# EAGLE design NICK_REEAL_SCHEMATIC (EAGLE 8.2.1)
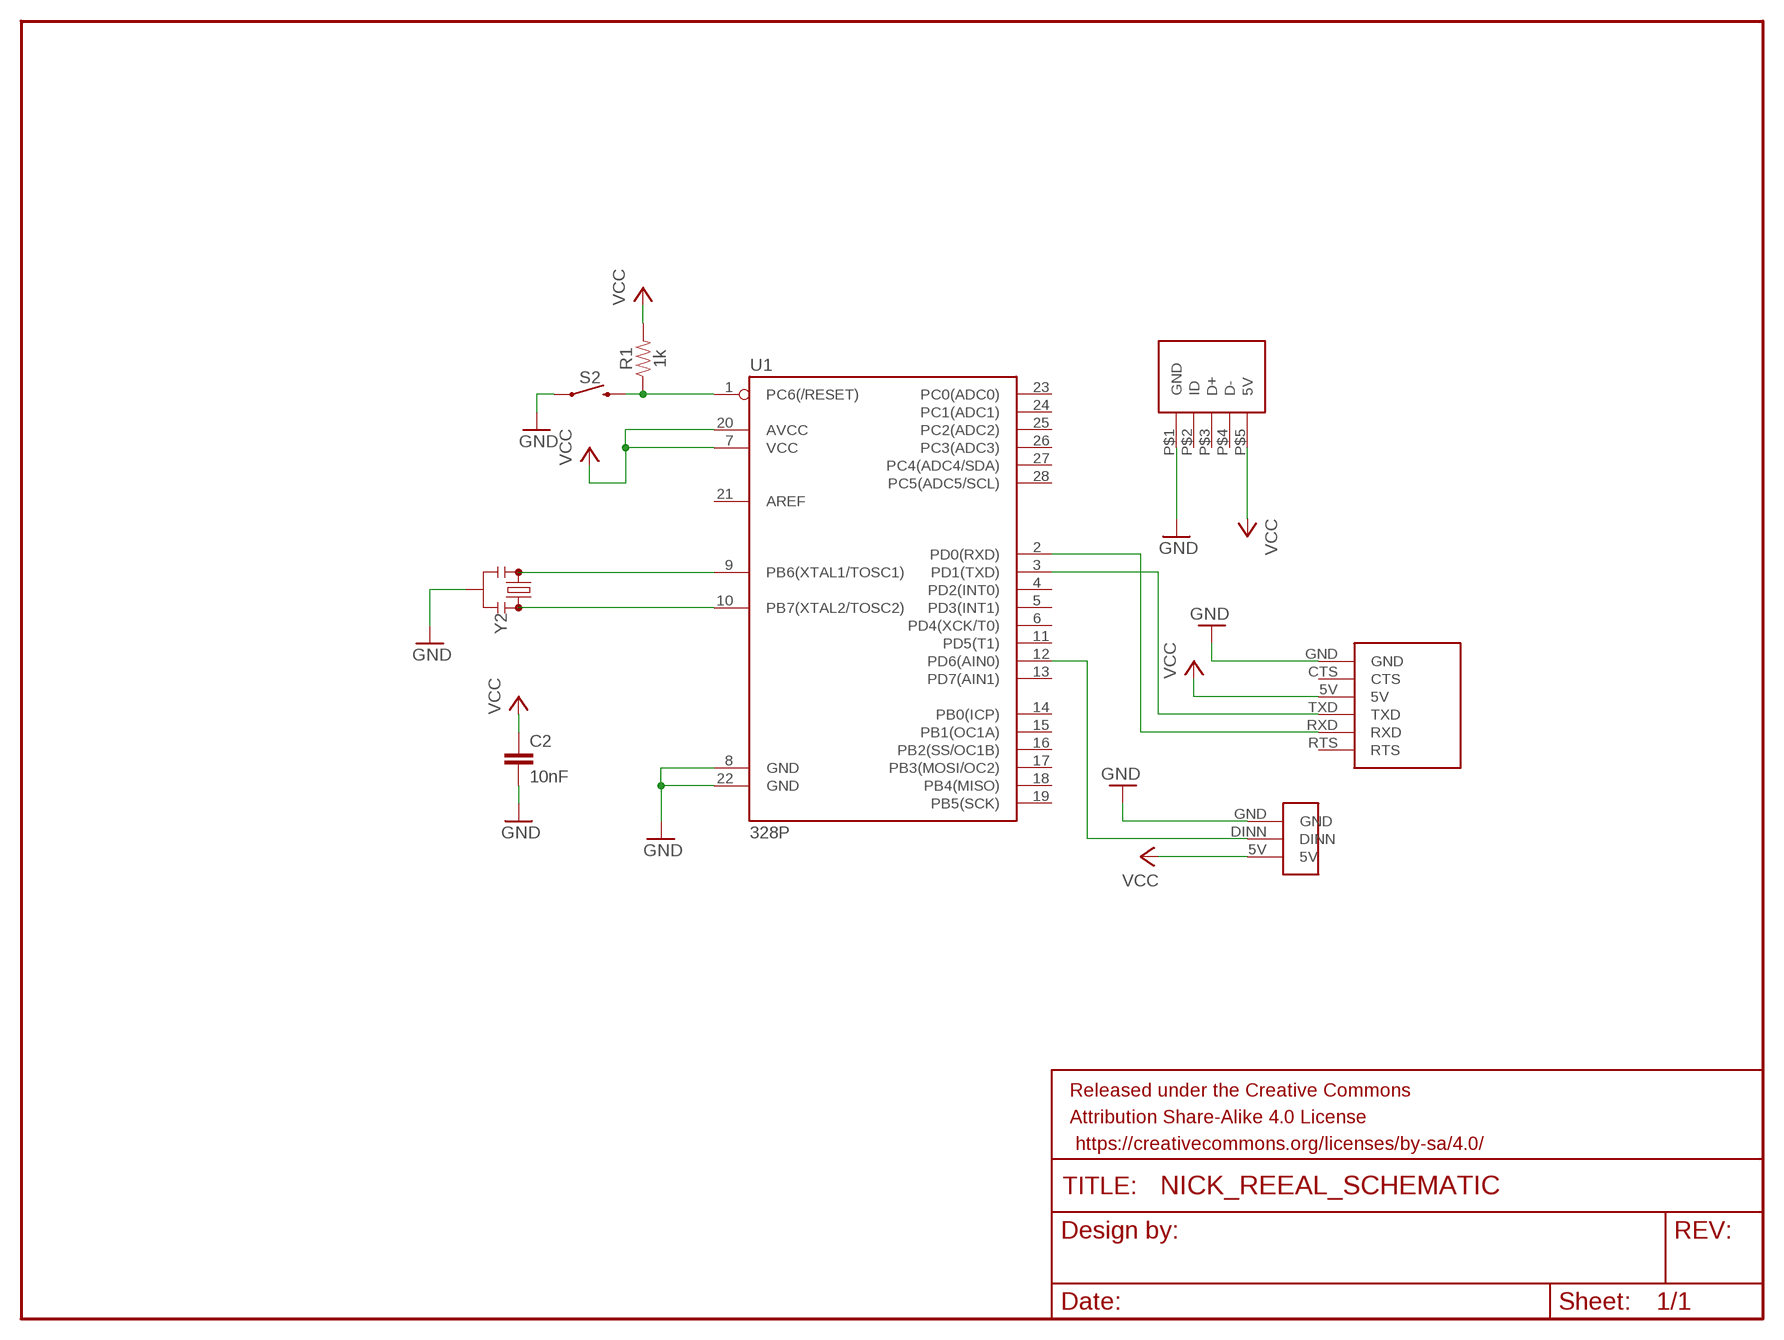
[diagram p0: schematic, sheet 1]

## Parts
C2  10nF  10NF-PTH-10MM-10000V-1-%  [CAP-PTH-10MM]
FRAME1  FRAME-LETTERNO_PACKAGE  [DUMMY]
R1  1k  1KOHM-HORIZ-1/4W-1%  [AXIAL-0.3]
S2  MOMENTARY-SWITCH-SPST-PTH-6.0MM  [TACTILE_SWITCH_PTH_6.0MM]
U1  328P  ATMEGA328P_PDIP  [DIP28]
U$1  USBCONNECTER  [USBCONNECTER]
U$2  PROGRAMCABLE  [PROGRAMCABLE]
U$3  8LEDCONNECTER  [8LEDCONNECTER]
Y2  RESONATORPTH-7.6X3.8  [RESONATOR-PTH-7.6X3.8]

## Nets
GND: C2.2 S2.1 U1.8(GND) U1.22(GND) U$1.P$1(GND) U$2.GND U$3.GND Y2.2
N$1: U1.9(PB6(XTAL1/TOSC1)) Y2.3
N$2: U1.10(PB7(XTAL2/TOSC2)) Y2.1
N$3: U1.3(PD1(TXD)) U$2.TXD
N$4: R1.P$1 S2.3 U1.1(PC6(/RESET))
N$5: U1.2(PD0(RXD)) U$2.RXD
N$6: U1.12(PD6(AIN0)) U$3.DINN
VCC: C2.1 R1.P$2 U1.7(VCC) U1.20(AVCC) U$1.P$5(5V) U$2.5V U$3.5V
Unconnected: U1.4(PD2(INT0)) U1.5(PD3(INT1)) U1.6(PD4(XCK/T0)) U1.11(PD5(T1)) U1.13(PD7(AIN1)) U1.14(PB0(ICP)) U1.15(PB1(OC1A)) U1.16(PB2(SS/OC1B)) U1.17(PB3(MOSI/OC2)) U1.18(PB4(MISO)) U1.19(PB5(SCK)) U1.21(AREF) U1.23(PC0(ADC0)) U1.24(PC1(ADC1)) U1.25(PC2(ADC2)) U1.26(PC3(ADC3)) U1.27(PC4(ADC4/SDA)) U1.28(PC5(ADC5/SCL)) U$1.P$2(ID) U$1.P$3(D+) U$1.P$4(D-) U$2.CTS U$2.RTS

## Library data of the parts
C2 = nick:10NF: 0.01uF/10nF/10,000pF ceramic capacitors A capacitor is a passive two-terminal electrical component used to store electrical energy temporarily in an electric field. CAP-09321; PROD_ID: CAP-09321
FRAME1 = SparkFun-Aesthetics:FRAME-LETTER: Schematic Frame - Letter Standard 8.5x11 US Letter frame; DESIGNER: Nobody; VERSION: v01
R1 = nick:1KOHM: 1kΩ resistor A resistor is a passive two-terminal electrical component that implements electrical resistance as a circuit element. Resistors act to reduce current flow, and, at the same time, act to lower voltage levels within circuits. - Wikipedia; PROD_ID: RES-12182
S2 = nick:MOMENTARY-SWITCH-SPST: Momentary Switch (Pushbutton) - SPST Normally-open (NO) SPST momentary switches (buttons, pushbuttons). Variants PTH-12MM - 12mm square, through-hole Momentary Pushbutton Switch - 12mm Square <https://www.sparkfun.com/products/9190> (COM-09190) PTH-6.0MM, PTH-6.0MM-KIT - 6.0mm square, through-hole Mini Pushbutton Switch <https://www.sparkfun.com/products/97> (COM-00097) KIT package intended for soldering kit's - only one side of pads' copper is exposed. PTH-RIGHT-ANGLE-KIT - Right-angle, through-hole Right Angle Tactile Button <https://www.sparkfun.com/products/10791> - Used on SparkFun BigTime Watch Kit <https://www.sparkfun.com/products/11734> SMD-12MM - 12mm square, surface-mount Tactile Button - SMD (12mm) <https://www.sparkfun.com/products/12993> (COM-12993) Used on SparkFun PicoBoard <https://www.sparkfun.com/products/11888> SMD-4.5MM - 4.5mm Square Trackball Switch Used on SparkFun Blackberry Trackballer Breakout <https://www.sparkfun.com/products/13169> SMD-4.6MMX2.8MM - 4.60mm x 2.80mm, surface mount Used on SparkFun SAMD21 Mini Breakout <https://www.sparkfun.com/products/13664> SMD-5.2MM, SMD-5.2-REDUNDANT - 5.2mm square, surface-mount Mini Pushbutton Switch - SMD <https://www.sparkfun.com/products/8720> (COM-08720) Used on Arduino Pro Mini <https://www.sparkfun.com/products/11114> REDUNDANT package connects both switch circuits together SMD-6.0X3.5MM - 6.0 x 3.5mm, surface mount Momentary Reset Switch SMD <https://www.sparkfun.com/products/8229> (COM-08229) SMD-6.2MM-TALL - 6.2mm square, surface mount Tactile Button - SMD (6mm) <https://www.sparkfun.com/products/12992> Used on SparkFun Digital Sandbox <https://www.sparkfun.com/products/12651> SMD-RIGHT-ANGLE - Right-angle, surface mount Used on SparkFun Block for Intel® Edison - Arduino <https://www.sparkfun.com/products/13036>; PROD_ID: SWCH-08441; SF_SKU: COM-00097
U1 = nick:ATMEGA328P_PDIP: Atmel 328P Through hole ATMEGA328P uC used in the Arduino 32kb flash, 1k EEPROM, 2k SRAM Datasheet <http://www.sparkfun.com/datasheets/Components/SMD/ATMega328.pdf> SparkFun Products Storefront component: AVR 28 Pin 20MHz 32K 6A/D - ATMega328P <https://www.sparkfun.com/products/9061> (COM-09061) SparkFun Simon Says - Through-Hole Soldering Kit <https://www.sparkfun.com/products/10547> (KIT-10547) SparkFun Learn to Solder - Simon Says <https://www.sparkfun.com/products/13708> (KIT-13708) SparkFun BigTime Watch Kit <https://www.sparkfun.com/products/11734> (KIT-11734) SparkFun ClockIt <https://www.sparkfun.com/products/10930> (KIT-10930) SparkFun Serial Enabled LCD Kit <https://www.sparkfun.com/products/10097> (LCD-10097) SparkFun Simon Tilts - Through Hole Soldering Kit <https://www.sparkfun.com/products/12634> (KIT-12634) SparkFun Frequency Counter Kit <https://www.sparkfun.com/products/10140> (KIT-10140) FabFM Radio Kit <https://www.sparkfun.com/products/11043> (KIT-11043) SparkFun Binary Blaster Kit <https://www.sparkfun.com/products/12037> (KIT-12037) SparkFun Metro-Gnome <https://www.sparkfun.com/products/9236> (KIT-09236) ATmega328 with Arduino Optiboot (Uno) <https://www.sparkfun.com/products/10524> (DEV-10524); PROD_ID: IC-09136
U$1 = nick:USBCONNECTER
U$2 = nick:PROGRAMCABLE
U$3 = nick:8LEDCONNECTER
Y2 = nick:RESONATOR: Resonators (Generic) Ceramic resonators are clock-generating components, often used to control timing in microcontrollers. They usually have 3 pins: two pins for oscillation, and one pin for ground. Compared to crystals, resonators have worse tolerance, but are usually much cheaper. Plus, they have built-in load capacitors! These devices are used on boards like the Arduino Pro 8MHz <https://www.sparkfun.com/products/11114> and Arduino Pro 16MHz <https://www.sparkfun.com/products/11113>.

## Net classes
0 default: width 0.457 mm, drill 0.457 mm, clearance 0.457 mm

## Board
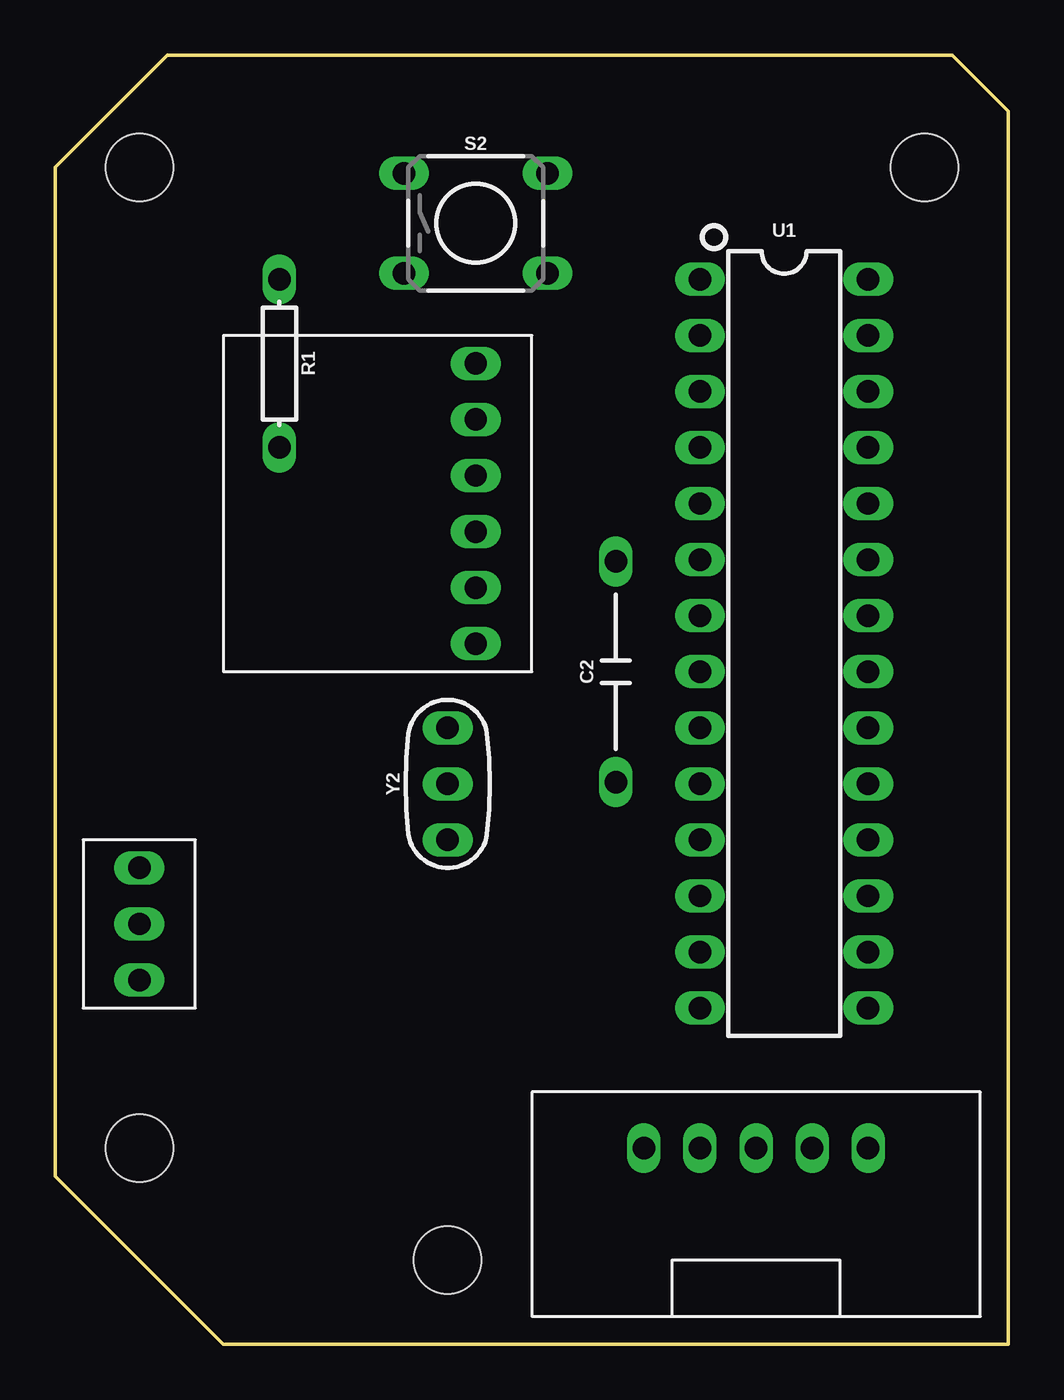
[diagram p1: board, top side]
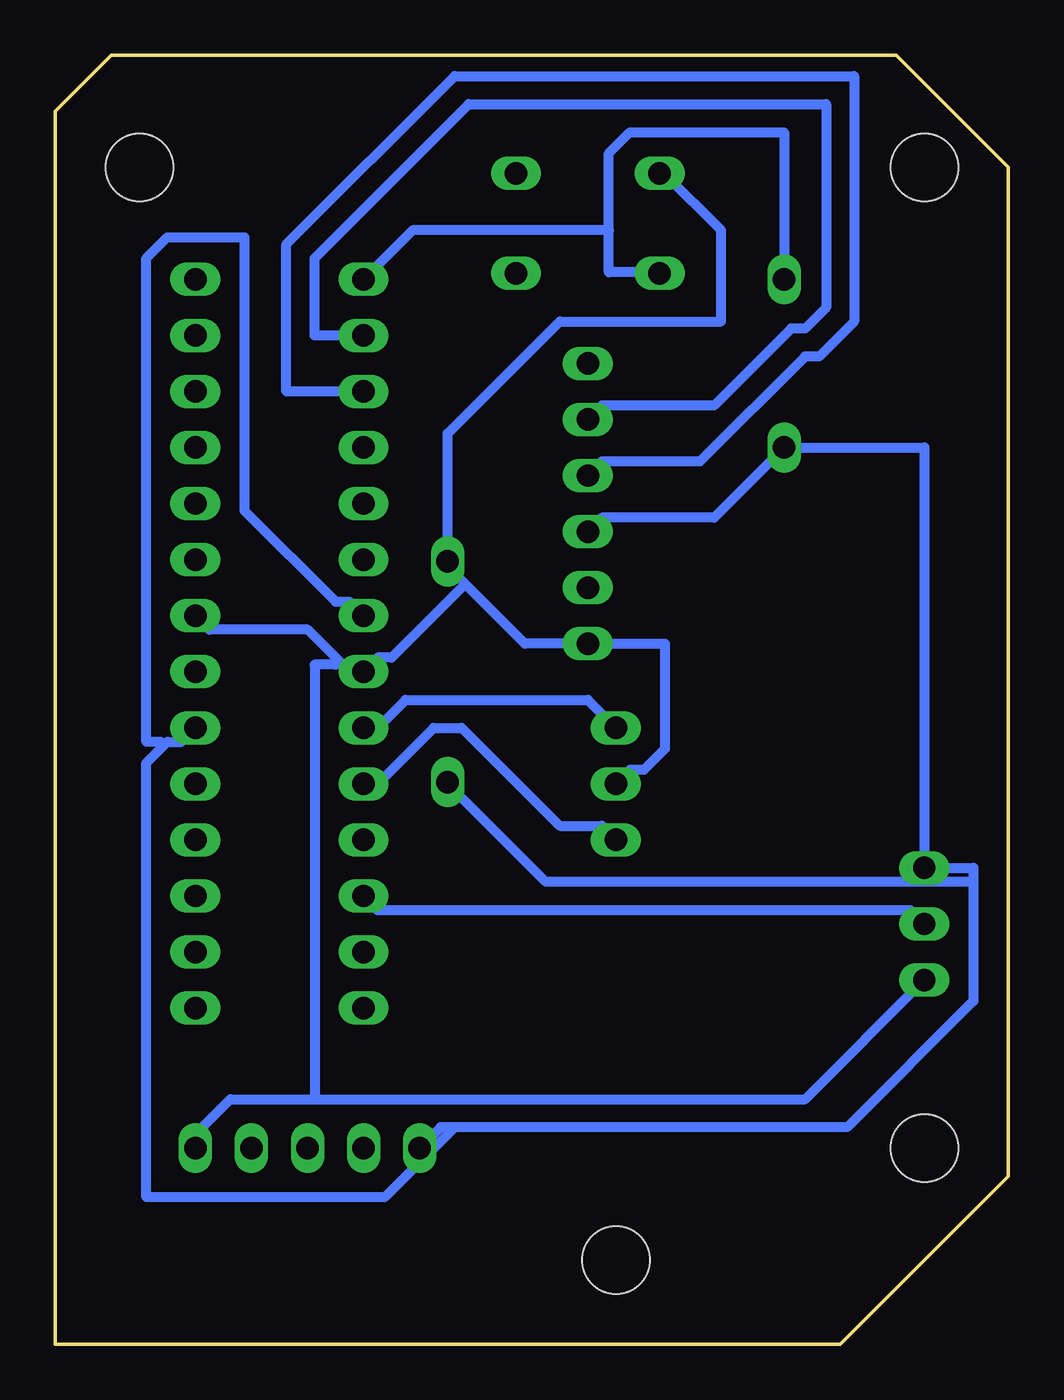
[diagram p2: board, bottom side, seen from below]

Size 43.18 x 58.42 mm. Coordinates in mm from the lower left corner, seen from the top.
Outline: 43.18,0 43.18,55.88 40.64,58.42 5.08,58.42 0,53.34 0,7.62 7.62,0 43.18,0
Copper layers (1*16): Top 0.035mm / dielectric 1.5mm / Bottom 0.035mm
Design rules "OthermillDRC_1_32_v2": minimum track width 8mil, minimum drill 0.8mm, track to track 0.794003125mm, track to pad 0.794003125mm, pad to pad 0.794003125mm, via to via 0.794003125mm, smd to smd 0mil, copper to edge 0mil, drill to drill 1mil, minimum pad ring 10mil, minimum via ring 10mil, stop-mask expansion 1mil, vias tented up to drill 30mil, thermal gap 10mil
Holes 3.05 mm at 3.81,8.89 17.78,3.81 3.81,53.34 39.37,53.34

### Footprints (pad centres in the part's own frame; a part is rotated, then mirrored left to right if it is on the bottom)
CAP-PTH-10MM = drill 1.016 long: 1 -5,0; 2 5,0
AXIAL-0.3 = drill 1.016 long: P$1 -3.81,0; P$2 3.81,0
TACTILE_SWITCH_PTH_6.0MM = drill 1.016 long: 1 -3.251,2.261; 2 3.251,2.261; 3 -3.251,-2.261; 4 3.251,-2.261
DIP28 = drill 1.016 long: 1 -16.51,-3.81; 2 -13.97,-3.81; 3 -11.43,-3.81; 4 -8.89,-3.81; 5 -6.35,-3.81; 6 -3.81,-3.81; 7 -1.27,-3.81; 8 1.27,-3.81; 9 3.81,-3.81; 10 6.35,-3.81; 11 8.89,-3.81; 12 11.43,-3.81; 13 13.97,-3.81; 14 16.51,-3.81; 15 16.51,3.81; 16 13.97,3.81; 17 11.43,3.81; 18 8.89,3.81; 19 6.35,3.81; 20 3.81,3.81; 21 1.27,3.81; 22 -1.27,3.81; 23 -3.81,3.81; 24 -6.35,3.81; 25 -8.89,3.81; 26 -11.43,3.81; 27 -13.97,3.81; 28 -16.51,3.81
USBCONNECTER = drill 1.016 long: P$1 5.08,2.54; P$2 7.62,2.54; P$3 10.16,2.54; P$4 12.7,2.54; P$5 15.24,2.54
PROGRAMCABLE = drill 1.016 long: 5V 6.35,2.54; CTS 3.81,2.54; GND 1.27,2.54; RTS 13.97,2.54; RXD 11.43,2.54; TXD 8.89,2.54
8LEDCONNECTER = drill 1.016 long: 5V 3.81,0; DINN 1.27,0; GND -1.27,0
RESONATOR-PTH-7.6X3.8 = drill 1.016 long: 1 -2.54,0; 2 0,0; 3 2.54,0

### Placement (x,y rotation side)
C2  25.4,30.48 90 top
FRAME1  -91.44,29.21 0 top  (outside the outline)
R1  10.16,44.45 270 top
S2  19.05,50.8 0 top
U1  33.02,31.75 270 top
U$1  41.91,11.43 180 top
U$2  21.59,30.48 90 top
U$3  3.81,17.78 90 top
Y2  17.78,25.4 90 top

### Tracks (layer width: path | path; a pad name or v marks a point on that pad's centre or on a via)
GND
  Bottom 0.457: U$3.GND 9.21,11.11 31.43,11.11 | 31.43,11.11 35.24,11.11 36.83,9.52 U$1.P$1 | Y2.2 17.14,26.04 16.51,26.04 15.56,26.99 15.56,31.75 U$2.GND 21.91,31.75 24.61,34.45 | 24.61,34.45 25.4,35.24 C2.2 25.4,41.28 20.32,46.35 13.02,46.35 13.02,50.48 15.56,53.02 S2.1 | 24.61,34.45 27.94,31.11 28.58,31.11 U1.8 29.21,30.8 30.16,30.8 30.32,30.96 | U1.22 36.19,32.39 31.75,32.39 30.32,30.96 | 31.43,11.11 31.43,30.8 30.48,30.8 30.32,30.96
N$1
  Bottom 0.457: Y2.3 19.05,29.21 27.3,29.21 28.58,27.94 U1.9
N$2
  Bottom 0.457: Y2.1 18.41,23.5 20.32,23.5 24.77,27.94 26.03,27.94 28.58,25.4 U1.10
N$3
  Bottom 0.457: U$2.TXD 18.41,40 13.97,40 9.21,44.77 8.57,44.77 6.98,46.35 6.98,57.47 25.08,57.47 32.7,49.85 32.7,43.18 U1.3
N$4
  Bottom 0.457: R1.P$1 10.16,54.93 17.14,54.93 18.1,53.97 18.1,50.48 | 18.1,50.48 18.1,48.58 15.88,48.58 S2.3 | U1.1 26.99,50.48 18.1,50.48
N$5
  Bottom 0.457: U$2.RXD 18.41,42.55 13.34,42.55 9.84,46.04 9.21,46.04 8.25,46.99 8.25,56.2 24.45,56.2 31.43,49.21 31.43,45.72 U1.2
N$6
  Bottom 0.457: U$3.DINN 4.45,19.68 28.58,19.68 U1.12
VCC
  Bottom 0.457: U$1.P$5 25.72,9.84 25.08,9.84 | 25.08,9.84 7.3,9.84 1.59,15.56 1.59,20.96 | 1.59,20.96 1.59,21.59 U$3.5V 3.81,40.64 R1.P$2 13.34,37.47 18.41,37.47 U$2.5V | 1.59,20.96 20.95,20.96 25.4,25.4 C2.1 | U1.20 37.47,27.31 38.1,27.31 38.26,27.15 | 38.26,27.15 39.05,26.35 39.05,6.67 28.26,6.67 25.08,9.84 | U1.7 29.84,33.66 30.48,33.66 34.61,37.78 34.61,50.16 38.1,50.16 39.05,49.21 39.05,27.31 38.42,27.31 38.26,27.15